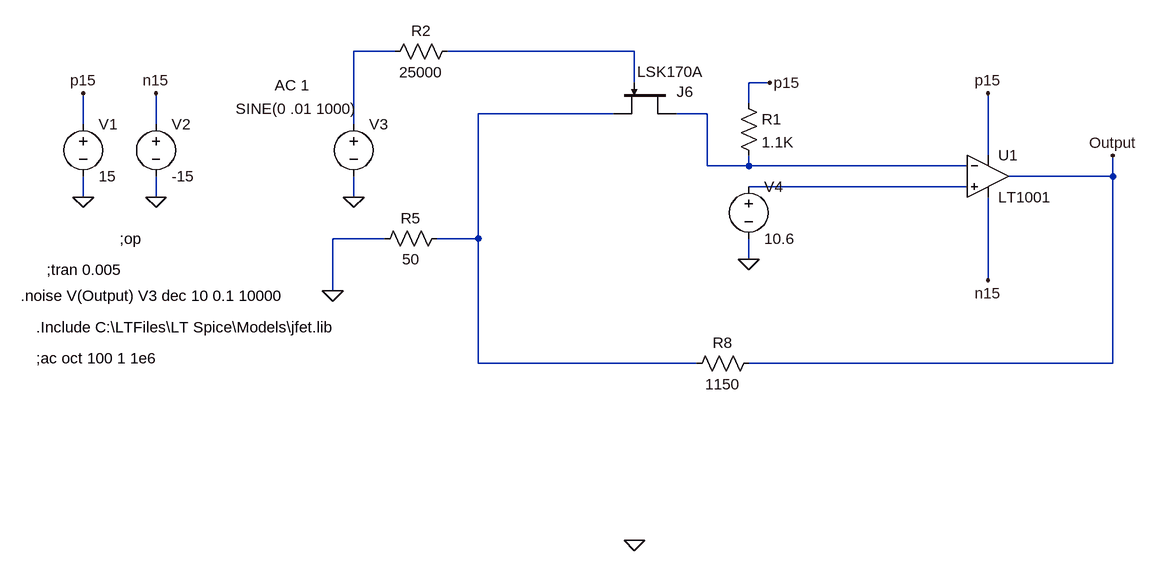
[diagram p0: schematic low_noise_4_fet_preampSingleEnded.asc]
low_noise_4_fet_preampSingleEnded.asc, the LTspice schematic file:
Version 4
SHEET 1 1400 772
WIRE -960 -224 -1024 -224
WIRE -592 -224 -880 -224
WIRE -592 -176 -592 -224
WIRE -384 -176 -416 -176
WIRE -416 -144 -416 -176
WIRE -624 -128 -832 -128
WIRE -480 -128 -528 -128
WIRE -1440 -112 -1440 -160
WIRE -1328 -112 -1328 -160
WIRE -1024 -112 -1024 -224
WIRE -48 -64 -48 -160
WIRE -480 -48 -480 -128
WIRE -416 -48 -416 -64
WIRE -416 -48 -480 -48
WIRE -80 -48 -416 -48
WIRE 144 -32 144 -64
WIRE 144 -32 -16 -32
WIRE -80 -16 -416 -16
WIRE -1440 0 -1440 -32
WIRE -1328 0 -1328 -32
WIRE -1024 0 -1024 -32
WIRE -976 64 -1056 64
WIRE -832 64 -832 -128
WIRE -832 64 -896 64
WIRE -416 96 -416 64
WIRE -48 128 -48 0
WIRE -1056 144 -1056 64
WIRE -832 256 -832 64
WIRE -496 256 -832 256
WIRE 144 256 144 -32
WIRE 144 256 -416 256
FLAG -1440 0 0
FLAG -1328 0 0
FLAG -1440 -160 p15
FLAG -1328 -160 n15
FLAG 144 -64 Output
FLAG -48 -160 p15
FLAG -48 128 n15
FLAG -1024 0 0
FLAG -592 528 0
FLAG -384 -176 p15
FLAG -1056 144 0
FLAG -416 96 0
SYMBOL voltage -1440 -128 R0
WINDOW 123 0 0 Left 2
WINDOW 39 0 0 Left 2
SYMATTR InstName V1
SYMATTR Value 15
SYMBOL voltage -1328 -128 R0
WINDOW 123 0 0 Left 2
WINDOW 39 0 0 Left 2
SYMATTR InstName V2
SYMATTR Value -15
SYMBOL voltage -1024 -128 R0
WINDOW 123 -121 -44 Left 2
WINDOW 39 0 0 Left 2
WINDOW 3 -181 -8 Left 2
SYMATTR Value2 AC 1
SYMATTR Value SINE(0 .01 1000)
SYMATTR InstName V3
SYMBOL res -432 -160 R0
SYMATTR InstName R1
SYMATTR Value 1.1K
SYMBOL res -864 -240 R90
WINDOW 0 0 56 VBottom 2
WINDOW 3 32 56 VTop 2
SYMATTR InstName R2
SYMATTR Value 25000
SYMBOL res -992 80 R270
WINDOW 0 32 56 VTop 2
WINDOW 3 0 56 VBottom 2
SYMATTR InstName R5
SYMATTR Value 50
SYMBOL res -400 240 R90
WINDOW 0 0 56 VBottom 2
WINDOW 3 32 56 VTop 2
SYMATTR InstName R8
SYMATTR Value 1150
SYMBOL njf -528 -176 R90
WINDOW 0 14 -27 VRight 2
WINDOW 3 -17 -42 VRight 2
SYMATTR InstName J6
SYMATTR Value LSK170A
SYMBOL voltage -416 -32 R0
WINDOW 123 0 0 Left 0
WINDOW 39 0 0 Left 0
SYMATTR InstName V4
SYMATTR Value 10.6
SYMBOL OpAmps\\LT1001 -48 -96 R0
SYMATTR InstName U1
TEXT -1512 200 Left 2 !.Include C:\\LTFiles\\LT Spice\\Models\\jfet.lib
TEXT -1512 248 Left 2 !;ac oct 100 1 1e6
TEXT -1536 152 Left 2 !.noise V(Output) V3 dec 10 0.1 10000
TEXT -1384 64 Left 2 !;op
TEXT -1496 112 Left 2 !;tran 0.005

The netlist it stands for:
* low_noise_4_fet_preampSingleEnded.asc
V1 p15 0 15
V2 n15 0 -15
V3 N001 0 SINE(0 .01 1000) AC 1
R1 p15 N004 1.1K
R2 N002 N001 25000
R5 0 N003 50
R8 Output N003 1150
J6 N004 N002 N003 LSK170A
V4 N005 0 10.6
XU1 N005 N004 p15 n15 Output LT1001  ; pins In+ In- V+ V- OUT
.model NJF NJF
.model PJF PJF
.lib standard.jft
.Include C:\LTFiles\LT Spice\Models\jfet.lib
;ac oct 100 1 1e6
.noise V(Output) V3 dec 10 0.1 10000
;op
;tran 0.005
.lib LTC.lib
.backanno
.end